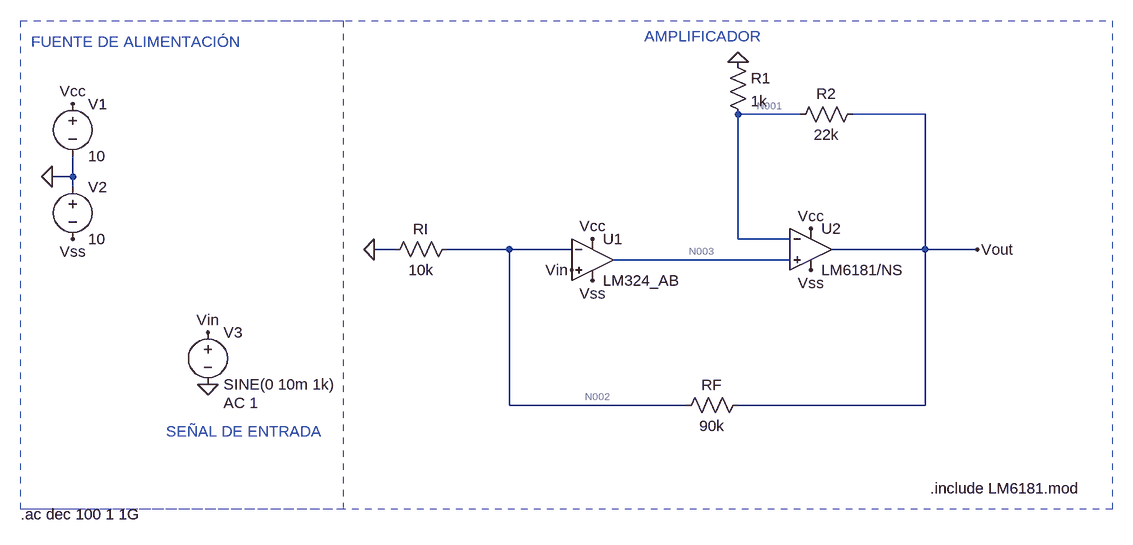
[diagram p0: schematic amp_vfa_cfa.asc]
* amp_vfa_cfa.asc
* U1: LM324_AB (symbol ZZZ\OpAmp\LM324_AB not available, pins judged from their places): In+=Vin In-=N002 V+=Vcc V-=Vss OUT=N003
RF Vout N002 90k
RI N002 0 10k
V1 Vcc 0 10
V2 0 Vss 10
V3 Vin 0 SINE(0 10m 1k) AC 1
R2 Vout N001 22k
R1 0 N001 1k
XU2 N003 N001 Vcc Vss Vout LM6181/NS  ; pins In+ In- V+ V- OUT
* AMPLIFICADOR
* FUENTE DE ALIMENTACIÓN
* SEÑAL DE ENTRADA
.ac dec 100 1 1G
.include LM6181.mod
.backanno
.end

* Results of the author's LTspice run, read from the files saved beside the schematic
* Operating Point, zero values left out:
*   V(vcc) = 10 V
*   V(vss) = -10 V
*   V(n002) = -41.52 µV
*   V(n003) = 2.669 mV
*   V(vout) = -4.449 mV
*   V(n001) = 5.065 mV
*   I(R1) = -5.065 µA
*   I(R2) = -432.5 nA
*   I(Ri) = -4.152 nA
*   I(Rf) = -48.97 nA
*   I(V3) = 43.57 nA
*   I(V2) = -7.111 mA
*   I(V1) = -7.116 mA
*   Ix(u1:IN+) = -43.57 nA
*   Ix(u1:IN-) = -44.81 nA
*   Ix(u1:VCC) = 360.1 µA
*   Ix(u1:VSS) = -358.9 µA
*   Ix(u1:OUT) = -1.1 µA
*   Ix(u2:1) = 1.1 µA
*   Ix(u2:2) = -5.498 µA
*   Ix(u2:99) = 6.756 mA
*   Ix(u2:50) = -6.752 mA
*   Ix(u2:41) = 481.4 nA
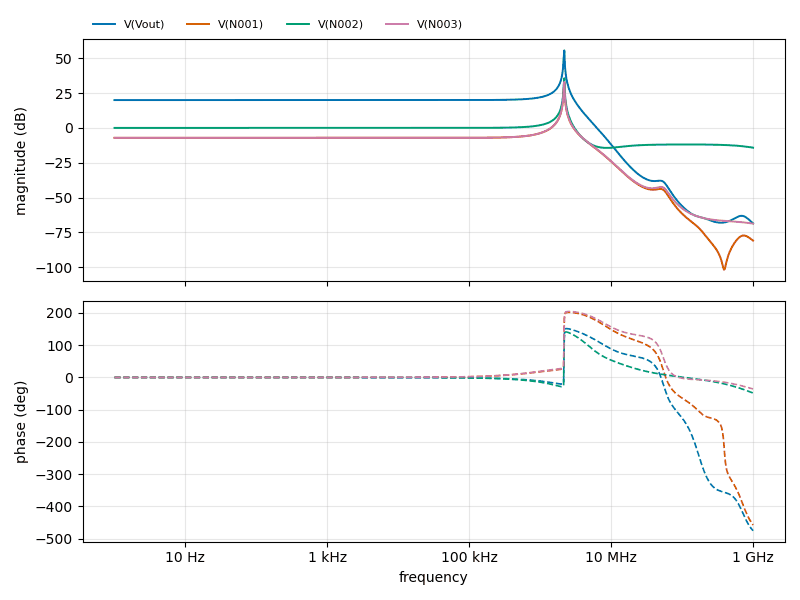
[diagram p1: AC Analysis of amp_vfa_cfa.asc, plotted from the saved traces]
* AC Analysis, 1 run:
*   V(Vout): 20.00 dB at 1 Hz, -68.58 dB at 1 GHz, peak 55.70 dB at 2.188 MHz, 3 dB below the peak at 2.163 MHz and 2.2 MHz
*   V(N001): -7.15 dB at 1 Hz, -80.97 dB at 1 GHz, peak 32.93 dB at 2.188 MHz, 3 dB below the peak at 2.163 MHz and 2.201 MHz
*   V(N002): 0.00 dB at 1 Hz, -14.20 dB at 1 GHz, peak 35.66 dB at 2.188 MHz, 3 dB below the peak at 2.163 MHz and 2.2 MHz
*   V(N003): -7.14 dB at 1 Hz, -68.78 dB at 1 GHz, peak 33.07 dB at 2.188 MHz, 3 dB below the peak at 2.163 MHz and 2.201 MHz